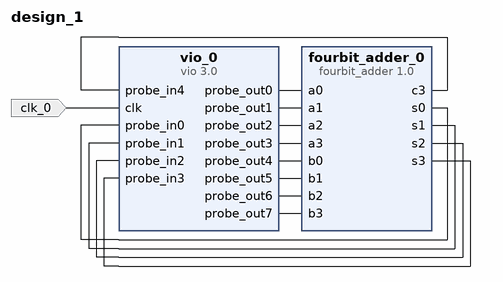
[diagram p0: block diagram of the top level]
# Vivado block design design_1, xc7a100tcsg324-1, Vivado 2023.2
create_bd_design design_1

create_bd_port -dir I -type clk clk_0

create_bd_cell -type ip -vlnv xilinx.com:hls:fourbit_adder:1.0 fourbit_adder_0
create_bd_cell -type ip -vlnv xilinx.com:ip:vio:3.0 vio_0
set_property -dict {CONFIG.C_NUM_PROBE_IN 5 CONFIG.C_NUM_PROBE_OUT 8} [get_bd_cells vio_0]

# ---- connections ----

connect_bd_net -net clk_0_1 [get_bd_ports clk_0] [get_bd_pins vio_0/clk]
connect_bd_net [get_bd_pins fourbit_adder_0/c3] [get_bd_pins vio_0/probe_in4]
connect_bd_net [get_bd_pins fourbit_adder_0/s0] [get_bd_pins vio_0/probe_in0]
connect_bd_net [get_bd_pins fourbit_adder_0/s1] [get_bd_pins vio_0/probe_in1]
connect_bd_net [get_bd_pins fourbit_adder_0/s2] [get_bd_pins vio_0/probe_in2]
connect_bd_net [get_bd_pins fourbit_adder_0/s3] [get_bd_pins vio_0/probe_in3]
connect_bd_net [get_bd_pins vio_0/probe_out0] [get_bd_pins fourbit_adder_0/a0]
connect_bd_net [get_bd_pins vio_0/probe_out1] [get_bd_pins fourbit_adder_0/a1]
connect_bd_net [get_bd_pins vio_0/probe_out2] [get_bd_pins fourbit_adder_0/a2]
connect_bd_net [get_bd_pins vio_0/probe_out3] [get_bd_pins fourbit_adder_0/a3]
connect_bd_net [get_bd_pins vio_0/probe_out4] [get_bd_pins fourbit_adder_0/b0]
connect_bd_net [get_bd_pins vio_0/probe_out5] [get_bd_pins fourbit_adder_0/b1]
connect_bd_net [get_bd_pins vio_0/probe_out6] [get_bd_pins fourbit_adder_0/b2]
connect_bd_net [get_bd_pins vio_0/probe_out7] [get_bd_pins fourbit_adder_0/b3]

validate_bd_design
save_bd_design
